# EasyEDA Pro project ESP32_Wroom.eprj, board PCB3
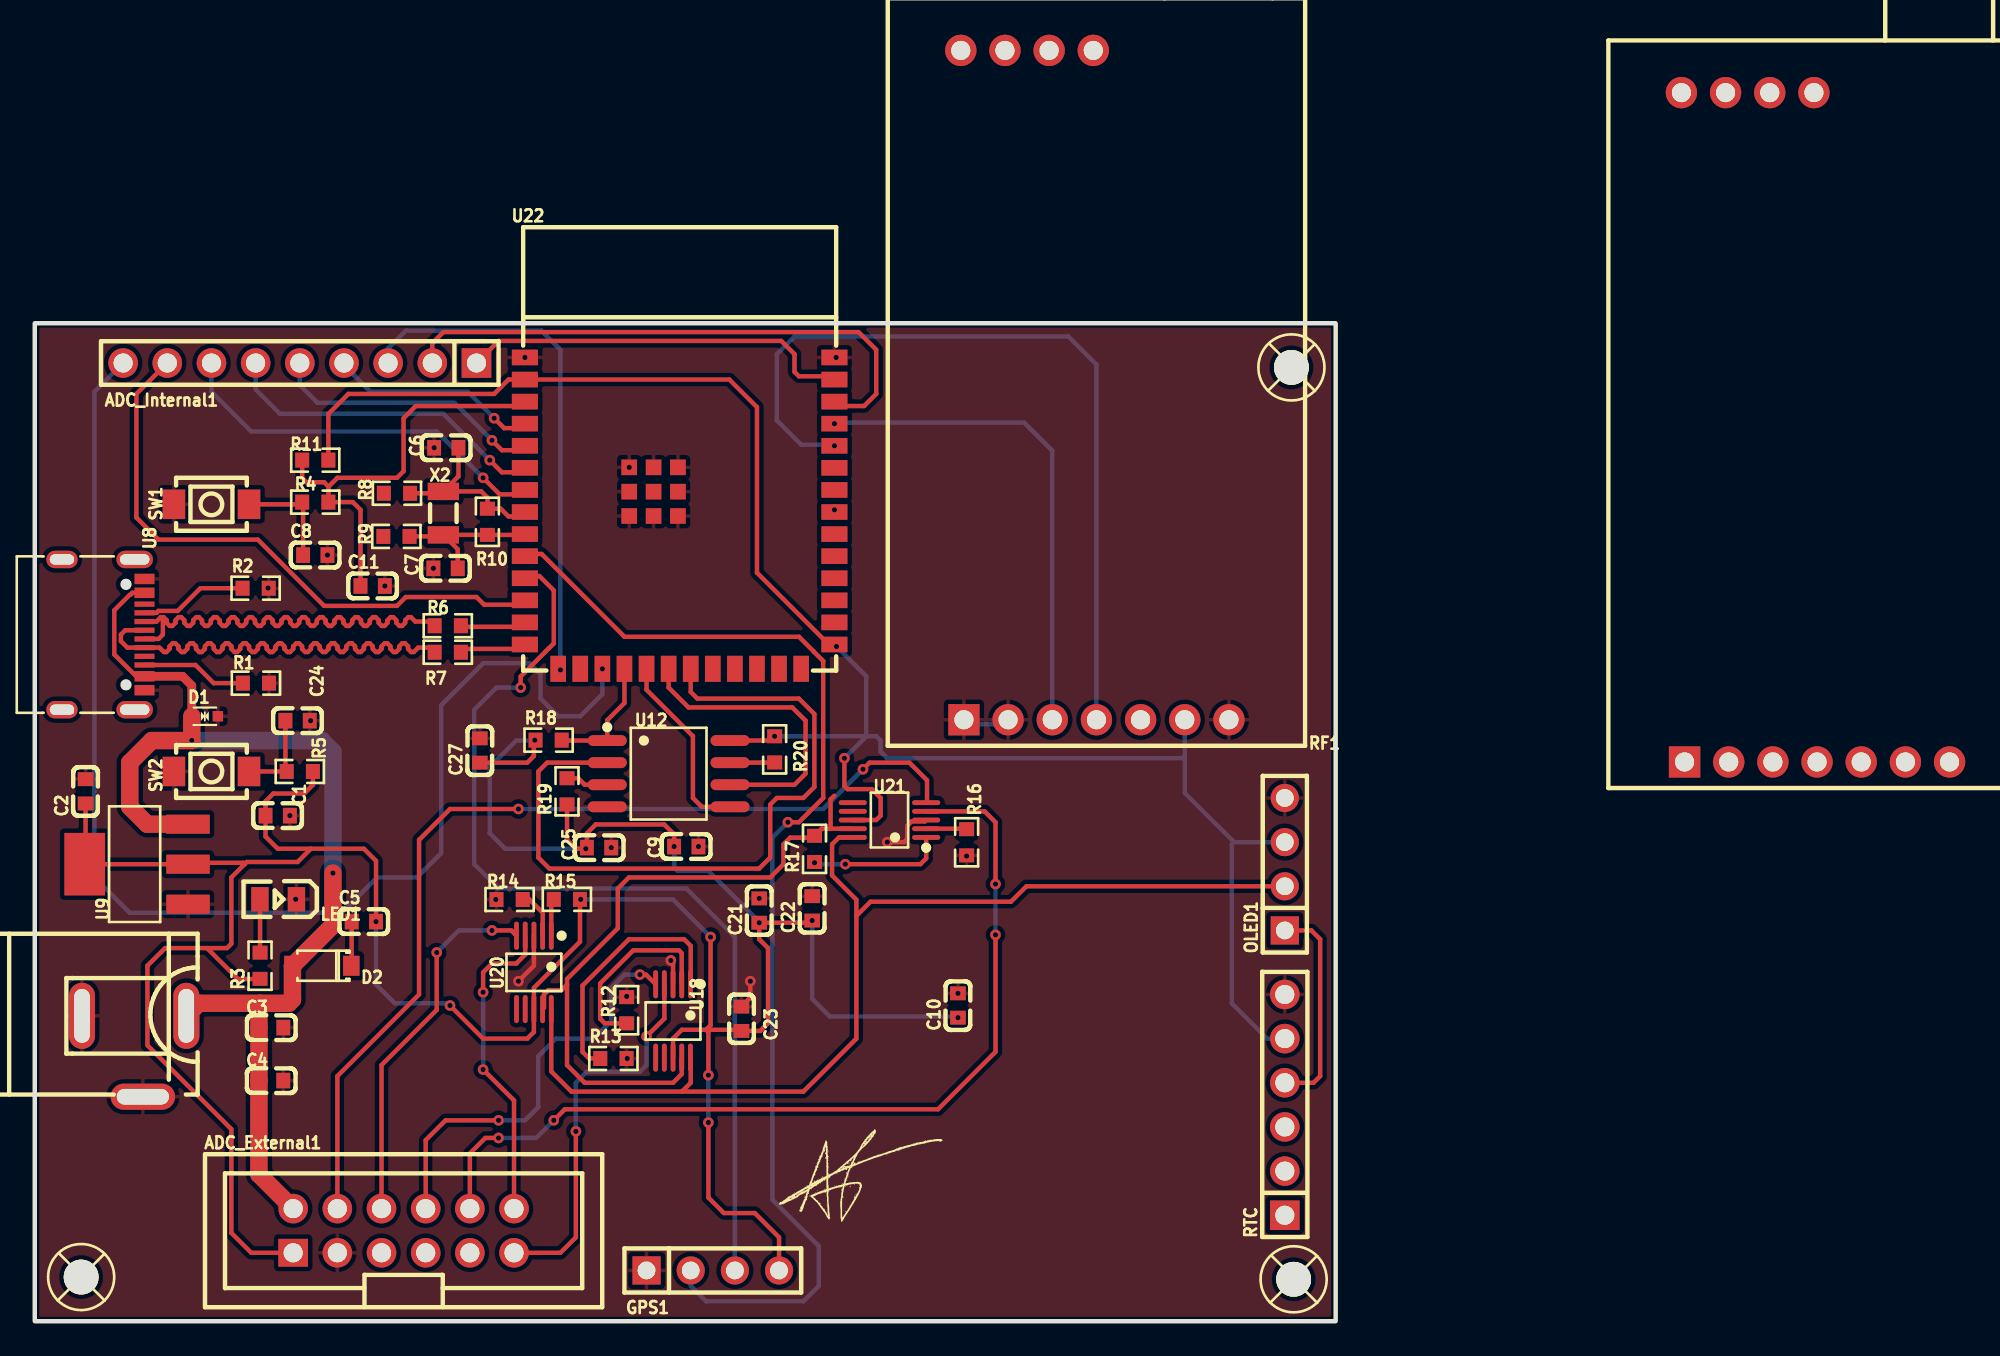
[diagram p5: board, top side]
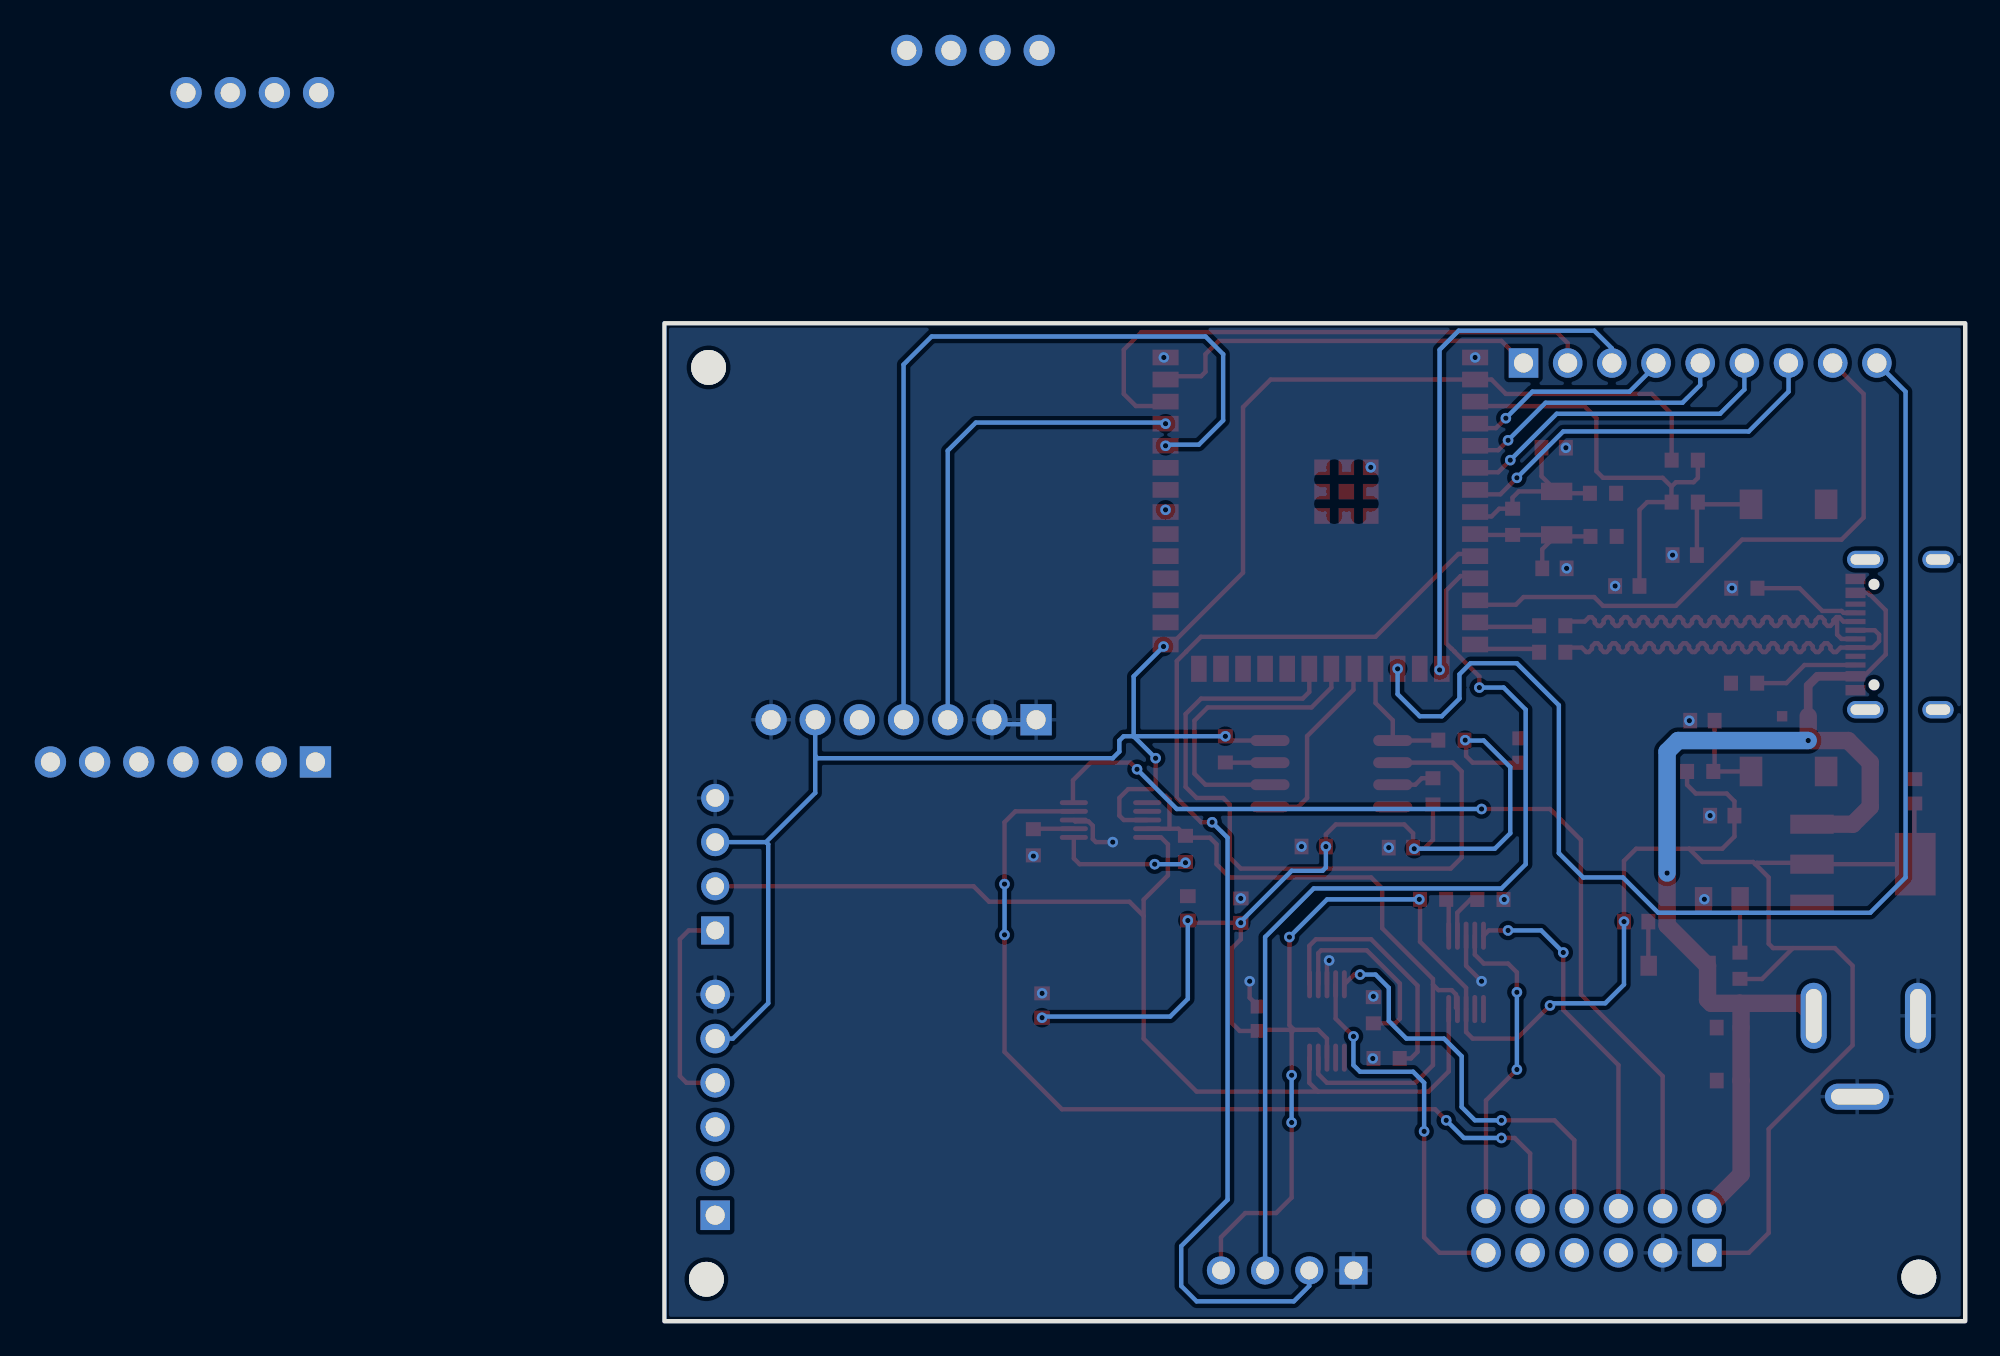
[diagram p6: board, bottom side, seen from below]

Outline 74.8 x 57.4 mm; copper layers: Top Layer, Bottom Layer. Coordinates in mm from the lower left corner of the outline.
Outline path: rectangle 0,57.4 74.8,0
Stack: Top Layer 0.035mm / Dielectric1 1.51mm FR4 er 4.5 / Bottom Layer 0.035mm

## Design rules (mm)
template: JLCPCB Capability(Two Layers Board)
spacing copperThickness1oz (default): track to track 0.102, other pairs 0.152 to 0.3
spacing copperThickness2oz: track to track 0.203, other pairs 0.152 to 0.3
track width copperThickness1oz (default): min 0.127, default 0.254, max 2.54
track width copperThickness2oz: min 0.203, default 0.254, max 2.54
differential pair differentialPair (default): width min 0.127, default 0.254, max 2.54; gap min 0.152, default 0.152
via viaSize (default): diameter min 0.5, default 0.61, max 10; hole min 0.3, default 0.305, max 6.3

## Placement (name value [footprint] x y rotation side)
ADC_External1  T821112A1R100CEU  [IDC-TH_12P-P2.54_BOOMELE-2X6P-2.54MM]  21.21 5.21 0 top
ADC_Internal1  PZ2.54-1*9  [HDR-TH_9P-P2.54-V-M]  15.24 55.12 180 top
C1  10uF  [C0603]  13.97 29.08 0 top
C2  100nF  [C0603]  2.92 30.48 90 top
C3  10uF  [C0603]  13.59 16.89 180 top
C4  100nF  [C0603]  13.59 13.84 180 top
C5  10uF  [C0603]  18.92 22.99 0 top
C6  12pF  [C0603]  23.66 50.24 0 top
C7  12pF  [C0603]  23.62 43.31 0 top
C8  100nF  [C0603]  16.13 44.07 0 top
C9  22uF  [C0603]  37.47 27.31 0 top
C10  100nF  [C0603]  53.09 18.16 90 top
C11  100nF  [C0603]  19.43 42.29 0 top
C21  1uF  [C0603]  41.66 23.62 90 top
C22  1uF  [C0603]  44.7 23.75 90 top
C23  1uF  [C0603]  40.64 17.4 90 top
C24  100nF  [C0603]  15.11 34.54 0 top
C25  100nF  [C0603]  32.45 27.24 180 top
C27  100nF  [C0603]  25.59 32.83 90 top
D1  LESD5D5.0CT1G  [SOD-523_L1.2-W0.8-LS1.6-BI]  9.78 34.8 0 top
D2  MBR0560  [SOD-123_L2.8-W1.8-LS3.7-RD]  16.51 20.45 180 top
GPS1  HX PH254-01-04-Z-L11.5 straight pin header  [HDR-TH_4P-HX-PH254-01-04-Z-L11.5]  38.99 2.92 0 top
LED1  KT-0805G  [LED0805-R-RD]  14 24.27 180 top
OLED1  HX PH254-01-04-Z-L11.5 straight pin header  [HDR-TH_4P-HX-PH254-01-04-Z-L11.5]  71.88 26.29 90 top
R1  5k  [R0603]  12.72 36.7 180 top
R2  5k  [R0603]  12.7 42.16 0 top
R3  330  [R0603]  12.95 20.45 90 top
R4  10K  [R0603]  16.13 47.12 180 top
R5  10K  [R0603]  15.24 31.62 0 top
R6  22  [R0603]  23.75 40.01 180 top
R7  22  [R0603]  23.75 38.48 180 top
R8  0  [R0603]  20.83 47.62 0 top
R9  0  [R0603]  20.8 45.14 0 top
R10  0  [R0603]  26.03 45.98 90 top
R11  0  [R0603]  16.13 49.53 0 top
R12  10K  [R0603]  34.04 17.89 90 top
R13  10K  [R0603]  33.27 15.11 0 top
R14  10K  [R0603]  27.31 24.26 180 top
R15  10K  [R0603]  30.6 24.27 0 top
R16  10K  [R0603]  53.59 27.55 270 top
R17  10K  [R0603]  44.84 27.17 90 top
R18  10K  [R0603]  29.55 33.42 0 top
R19  10K  [R0603]  30.61 30.48 90 top
R20  10K  [R0603]  42.54 32.89 90 top
RF1  E32-900T30D  [WIRELM-TH_E32-900T30D]  60.96 53.85 180 top
RF1#2  -  [WIRELM-TH_E32-900T30D]  102.4 51.42 180 top
RTC  HX PH254-01-06-Z-L11.5 through hole header  [HDR-TH_6P-P2.54-V-M]  71.88 12.45 90 top
SCREW1  -  [Screw-Hole-M2]  72.26 54.86 0 top
SCREW2  -  [Screw-Hole-M2]  72.39 2.41 0 top
SCREW2#2  -  [Screw-Hole-M2]  2.67 2.54 0 top
SW1  HX 3x4x2-2P-1.6N TACTILE SWITCH  [KEY-SMD_L4.0-W3.0-LS4.9-1]  10.16 46.99 0 top
SW2  HX 3x4x2-2P-1.6N TACTILE SWITCH  [KEY-SMD_L4.0-W3.0-LS4.9-1]  10.16 31.62 0 top
U8  TYPE C-ZL-104PWB  [TYPE-C-SMD_HDGC_TYPE-C-ZL-104PWB]  3.94 39.5 270 top
U9  AMS1117-3.3  [SOT-223-3_L6.5-W3.4-P2.30-LS7.0-BR]  5.84 26.29 0 top
U12  W25Q128JVSIQ  [SOIC-8_L5.3-W5.3-P1.27-LS8.0-BL]  36.45 31.5 270 top
U18  ADS1115IDGSR  [MSOP-10_L3.0-W3.0-P0.50-LS5.0-BL]  36.7 17.27 180 top
U19  POWER-JACK  [DC-IN-TH_POWER-JACK]  5.72 15.24 0 top
U20  ADS1115IDGSR  [MSOP-10_L3.0-W3.0-P0.50-LS5.0-BL]  28.7 20.07 180 top
U21  ADS1115IDGSR  [MSOP-10_L3.0-W3.0-P0.50-LS5.0-BL]  49.15 28.83 90 top
U22  2.4GHz  [WIFIM-SMD_ESP32-S3-WROOM-1-N8]  37.08 46.48 0 top
X2  32.768kHz  [FC-135R_L3.2-W1.5]  23.5 46.48 270 top

## Footprints (pads in the part's own frame, mm; a bottom-side part is the same pattern mirrored in y, then rotated)
C0603
  rect 0.8x0.9 smd: 1(-0.7,0) 2(0.7,0)
DC-IN-TH_POWER-JACK
  oval 1.5x3.8 hole 0.9x3.1: 1(2.999,2.325) 2(-2.999,2.325)
  oval 3.7x1.5 hole 3x0.9: 3(0.5,-2.325)
FC-135R_L3.2-W1.5
  rect 1x1.8 smd: 1(-1.25,0) 2(1.25,0)
HDR-TH_4P-HX-PH254-01-04-Z-L11.5
  rect 1.62x1.62 hole 1.02: 1(-3.81,0)
  round 1.62 hole 1.02: 2(-1.27,0) 3(1.27,0) 4(3.81,0)
HDR-TH_6P-P2.54-V-M
  rect 1.7x1.7 hole 1.1: 1(-6.35,0)
  round 1.7 hole 1.1: 2(-3.81,0) 3(-1.27,0) 4(1.27,0) 5(3.81,0) 6(6.35,0)
HDR-TH_9P-P2.54-V-M
  rect 1.7x1.7 hole 1.1: 1(-10.16,0)
  round 1.7 hole 1.1: 2(-7.62,0) 3(-5.08,0) 4(-2.54,0) 5(0,0) 6(2.54,0) 7(5.08,0) 8(7.62,0) 9(10.16,0)
IDC-TH_12P-P2.54_BOOMELE-2X6P-2.54MM
  rect 1.7x1.6 hole 1.1: 1(-6.35,-1.27)
  round 1.7 hole 1.1: 2(-6.35,1.27) 3(-3.81,-1.27) 4(-3.81,1.27) 5(-1.27,-1.27) 6(-1.27,1.27) 7(1.27,-1.27) 8(1.27,1.27) 9(3.81,-1.27) 10(3.81,1.27) 11(6.35,-1.27) 12(6.35,1.27)
KEY-SMD_L4.0-W3.0-LS4.9-1
  rect 1.3x1.7 smd: 1(-2.159,0) 2(2.159,0)
LED0805-R-RD
  rect 1x1.399 smd: 1(1.05,0) 2(-1.05,0)
MSOP-10_L3.0-W3.0-P0.50-LS5.0-BL
  oval 0.28x1.62 smd: 1(-1,-2.11) 2(-0.5,-2.11) 3(0,-2.11) 4(0.5,-2.11) 5(1,-2.11) 6(1,2.11) 7(0.5,2.11) 8(0,2.11) 9(-0.5,2.11) 10(-1,2.11)
R0603
  rect 0.806x0.864 smd: 1(-0.753,0) 2(0.753,0)
Screw-Hole-M2
  round 2 hole 2: 1(0,0)
SOD-123_L2.8-W1.8-LS3.7-RD
  rect 0.95x1.15 smd: 1(-1.692,0) 2(1.692,0)
SOD-523_L1.2-W0.8-LS1.6-BI
  rect 0.6x0.6 smd: 1(-0.75,0) 2(0.75,0)
SOIC-8_L5.3-W5.3-P1.27-LS8.0-BL
  oval 0.63x2.25 smd: 1(-1.905,-3.53) 2(-0.635,-3.53) 3(0.635,-3.53) 4(1.905,-3.53) 5(1.905,3.53) 6(0.635,3.53) 7(-0.635,3.53) 8(-1.905,3.53)
SOT-223-3_L6.5-W3.4-P2.30-LS7.0-BR
  rect 2.5x1.1 smd: 1(2.97,-2.3) 2(2.97,0) 3(2.97,2.3)
  rect 2.34x3.6 smd: 4(-2.97,0)
TYPE-C-SMD_HDGC_TYPE-C-ZL-104PWB
  oval 1x2.1 hole 0.6x1.7: 12(-4.32,1.808) 13(4.32,1.808)
  oval 1x1.8 hole 0.6x1.4: 14(-4.32,-2.373) 15(4.32,-2.373)
  rect 0.6x1.15 smd: A1B12(-3.2,2.373) A4B9(-2.4,2.373) A9B4(2.4,2.373) A12B1(3.2,2.373)
  rect 0.3x1.15 smd: A5(-1.25,2.373) A6(-0.25,2.373) A7(0.25,2.373) A8(1.25,2.373) B5(1.75,2.373) B6(0.75,2.373) B7(-0.75,2.373) B8(-1.75,2.373)
WIFIM-SMD_ESP32-S3-WROOM-1-N8
  rect 1.5x0.9 smd: 1(-8.9,8.954) 2(-8.9,7.684) 3(-8.9,6.415) 4(-8.9,5.144) 5(-8.9,3.874) 6(-8.9,2.604) 7(-8.9,1.335) 8(-8.9,0.065) 9(-8.9,-1.206) 10(-8.9,-2.475) 11(-8.9,-3.745) 12(-8.9,-5.016) 13(-8.9,-6.285) 14(-8.9,-7.556) 27(8.9,-7.556) 28(8.9,-6.285) 29(8.9,-5.016) 30(8.9,-3.745) 31(8.9,-2.475) 32(8.9,-1.206) 33(8.9,0.065) 34(8.9,1.335) 35(8.9,2.604) 36(8.9,3.874) 37(8.9,5.144) 38(8.9,6.415) 39(8.9,7.684) 40(8.9,8.954)
  rect 0.9x1.5 smd: 15(-6.985,-8.954) 16(-5.715,-8.954) 17(-4.445,-8.954) 18(-3.175,-8.954) 19(-1.905,-8.954) 20(-0.635,-8.954) 21(0.635,-8.954) 22(1.905,-8.954) 23(3.175,-8.954) 24(4.445,-8.954) 25(5.715,-8.954) 26(6.985,-8.954)
  rect 0.9x0.9 smd: 41(-2.9,2.635) 41(-2.9,1.235) 41(-2.9,-0.165) 41(-1.5,2.635) 41(-1.5,1.235) 41(-1.5,-0.165) 41(-0.1,2.635) 41(-0.1,1.235) 41(-0.1,-0.165)
WIRELM-TH_E32-900T30D
  rect 1.8x1.8 hole 1.1: 1(7.53,19.25)
  round 1.8 hole 1.1: 2(4.99,19.25) 3(2.45,19.25) 4(-0.09,19.25) 5(-2.63,19.25) 6(-5.17,19.25) 7(-7.71,19.25) 8(0.09,-19.25) 9(2.63,-19.25) 10(5.17,-19.25) 11(7.71,-19.25)

## Nets
As in the schematic, except:
3.3V: ADC_External1.1 C1.1 C2.1 C5.2 C9.1 C10.1 C21.1 C22.1 C23.1 C25.2 C27.1 GPS1.4 OLED1.3 R3.1 R5.2 R11.2 R15.2 R18.1 R19.1 R20.2 RF1.6 RF1#2.6 RTC.5 U9.2 U9.4 U12.8 U18.8 U20.8 U21.8 U22.2 U22.27
GND: ADC_External1.3 C1.2 C2.2 C3.1 C4.1 C6.1 C7.1 C8.2 C9.2 C10.2 C11.2 C21.2 C22.2 C23.2 C24.2 C25.1 C27.2 D1.2 GPS1.1 LED1.2 OLED1.4 R1.1 R2.2 R12.2 R13.2 R14.2 R16.2 RF1.1 RF1.2 RF1.7 RF1#2.1 RF1#2.2 RF1#2.7 RTC.6 SW1.1 SW2.1 U8.A1B12 U8.A12B1 U9.1 U12.4 U18.3 U19.2 U19.3 U20.3 U21.3 U22.1 U22.40 U22.41
GP40: RF1.5 RF1#2.5 U22.33
RX: RF1.4 RF1#2.4 U22.36
TX: RF1.3 RF1#2.3 U22.37

Pads without a net: ADC_External1 5 7 9; RF1 8 9 10 11; RF1#2 8 9 10 11; SCREW1 1; SCREW2 1; SCREW2#2 1; U8 12 13 14 15 A8 B8; U18 6 7; U20 6 7; U21 6 7; U22 16 22 23 24 25 26 28 29 30 31 32

## Via types
v1: diameter 0.61, hole 0.305, Top Layer to Bottom Layer, 67 vias

## Routing (per net, layer and track width the routed paths; a pad name or vN(x,y) marks a point on that pad's centre or on a via; arc(x,y) is an arc through that point)
3.3V: length 297.5
  Top Layer w0.254: 12.06,26.29 11.3,25.53 11.3,21.72 11.05,21.46 9.91,21.46 ; 12.06,26.29 12.19,26.42 15.11,26.42 15.88,27.18 ; 12.06,26.29 11.99,26.37 8.89,26.37 U9.2 U9.4 2.92,26.34 C2.1 ; v1(42.54,33.65) 42.3,33.4 U12.8 ; 9.91,21.46 7.49,21.46 6.48,20.45 6.48,15.88 11.3,11.05 11.3,5.08 12.45,3.94 ADC_External1.1 ; 9.91,21.46 11.68,19.69 12.95,19.69 R3.1 ; R5.2 15.99,30.85 15.49,30.35 13.72,30.35 13.27,29.91 C1.1 13.27,27.88 13.97,27.18 15.88,27.18 ; 38.6,16.76 38.86,17.03 v1(38.86,22.1) ; 38.6,16.76 38.74,16.63 v1(38.74,14.15) ; 38.6,16.76 40.57,16.76 C23.1 41.72,16.7 42.16,17.15 42.16,21.46 41.66,21.97 41.66,22.92 v1(41.66,22.92) 44.58,22.92 v1(44.7,23.05) ; 38.6,16.76 37.21,16.76 36.7,16.26 U18.8 ; v1(38.74,11.43) 38.74,7.11 39.62,6.22 41.4,6.22 42.8,4.83 GPS1.4 ; R18.1 28.7,33.33 28.7,32.51 28.32,32.13 C27.1 ; R19.1 30.61,27.69 31.12,27.18 v1(31.69,27.18) C25.2 31.75,28.07 32.26,28.58 36.19,28.58 36.77,28.01 v1(36.77,27.31) ; v1(46.1,38.81) 45.78,38.81 41.53,43.06 41.53,52.58 39.94,54.17 U22.2 27.24,54.17 26.42,53.34 18.03,53.34 16.88,52.19 R11.2 ; 15.88,27.18 18.92,27.18 19.62,26.48 v1(19.62,22.99) ; v1(23.88,18.16) 25.78,16.26 28.32,16.26 28.7,16.64 U20.8 28.7,19.18 31.35,21.83 R15.2 ; U21.8 48.39,28.83 48.64,29.08 48.64,30.1 48.13,30.61 46.74,30.61 46.56,30.79 v1(46.56,32.39)
  Bottom Layer w0.254: 68.96,27.56 68.83,27.43 68.83,18.29 70.87,16.26 RTC.5 ; 68.96,27.56 66.13,30.39 66.13,32.52 ; 68.96,27.56 72.52,27.56 ; v1(53.09,17.46) 53.02,17.53 45.72,17.53 44.7,18.54 v1(44.7,23.05) ; v1(36.77,27.31) 36.77,26.1 36.96,25.91 38.74,25.91 41.66,22.99 ; v1(31.69,27.18) 27.05,27.18 26.16,28.07 26.16,31.88 27.69,33.4 28.7,33.4 ; v1(31.39,24.27) 36.69,24.27 v1(38.86,22.1) ; v1(38.74,14.15) v1(38.74,11.43) ; 47.82,33.65 47.82,37.09 v1(46.1,38.81) ; 47.82,33.65 v1(46.56,32.39) ; 47.82,33.65 48.4,33.65 48.64,33.4 48.64,32.77 49.02,32.39 66,32.39 66.13,32.52 ; 47.82,33.65 v1(42.54,33.65) ; v1(23.88,18.16) 23.75,18.29 20.7,18.29 19.62,19.37 v1(19.62,22.99) ; 66.13,32.52 RF1.6
  vias: v1(28.75,33.42)
GND: length 12.1
  Top Layer w0.254: U21.3 51.18,28.75 50.42,28.75 50.17,28.5 50.17,27.74 49.99,27.56 v1(49.02,27.56) ; v1(27.81,19.56) 28.7,20.45 U20.3 ; v1(41.15,19.56) 41.15,18.61 C23.2 ; U18.3 36.7,20.62 v1(36.58,20.75)
  Bottom Layer w0.254: 56.05,34.52 55.87,34.34 53.69,34.34 RF1.1
  vias: v1(13.42,42.17) v1(14.67,29.08) v1(15,24.27) v1(15.86,34.54) v1(16.83,44.07) v1(20.13,42.29) v1(22.96,50.24) v1(22.92,43.31) v1(26.51,24.26) v1(28.18,55.44) v1(33.15,27.24) v1(34.04,18.68) v1(34.07,15.11) v1(34.18,49.12) v1(38.16,27.31) v1(41.66,24.32) v1(46.08,55.44) v1(53.09,18.86) v1(53.59,26.76)
VBUS: length 66.2
  Top Layer w0.254: U8.A4B9 5.61,41.9 5.5,41.78 5.46,41.78 4.57,40.89 4.57,38.35 5.83,37.1 U8.A9B4
  Top Layer w0.5: D1.1 9.03,36.56 8.5,37.1 U8.A9B4
  Top Layer w1: 12.96,18.29 14.61,18.29 14.82,18.5 D2.2 17.15,22.77 v1(17.15,25.78) ; 12.96,18.29 9.44,18.29 U19.1 ; 12.96,18.29 12.89,18.22 C3.2 12.89,13.85 C4.2 12.89,8.45 ADC_External1.2 ; D1.1 v1(9.03,33.4) 6.73,33.4 5.46,32.13 5.46,29.59 6.46,28.59 U9.3
  Bottom Layer w1: v1(9.03,33.4) 16.51,33.4 17.15,32.77 v1(17.15,25.78)
A1: length 22.4
  Top Layer w0.254: v1(31.12,10.92) 31.12,4.83 30.23,3.94 ADC_External1.11 ; U18.4 36.2,17.41 v1(35.18,16.38)
  Bottom Layer w0.254: v1(31.12,10.92) 31.12,13.72 31.75,14.35 34.8,14.35 35.18,14.73 v1(35.18,16.38)
A2: length 24.2
  Top Layer w0.254: ADC_External1.8 22.48,10.41 23.62,11.56 v1(26.67,11.56) ; v1(34.8,19.94) 35.15,19.94 U18.5
  Bottom Layer w0.254: v1(26.67,11.56) 28.19,11.56 28.96,12.32 28.96,15.24 29.97,16.26 32.13,16.26 33.15,17.27 33.15,19.18 33.91,19.94 v1(34.8,19.94)
A3: length 18.3
  Top Layer w0.254: v1(25.78,14.48) 27.56,12.7 ADC_External1.12 ; v1(25.78,18.92) 25.78,20.07 26.29,20.57 27.69,20.57 28.2,21.09 U20.4
  Bottom Layer w0.254: v1(25.78,14.48) v1(25.78,18.92)
A4: length 21.3
  Top Layer w0.254: v1(26.29,22.48) 27.4,22.48 U20.5 ; ADC_External1.6 19.94,14.73 23.11,17.91 v1(23.11,21.21)
  Bottom Layer w0.254: v1(23.11,21.21) 24.38,22.48 v1(26.29,22.48)
A5: length 53.3
  Top Layer w0.254: v1(55.25,25.15) 55.25,28.7 54.62,29.33 U21.4 ; ADC_External1.10 25.02,9.65 25.91,10.54 v1(26.67,10.54) ; v1(29.84,11.56) 30.48,12.19 51.94,12.19 55.25,15.49 v1(55.25,22.23)
  Bottom Layer w0.254: v1(29.84,11.56) 28.83,10.54 v1(26.67,10.54) ; v1(55.25,25.15) v1(55.25,22.23)
A6: length 55.9
  Top Layer w0.254: ADC_External1.4 17.4,14.1 22.1,18.8 22.1,27.69 23.88,29.46 v1(27.81,29.46) ; v1(47.62,31.75) 48.01,32.13 50.29,32.13 51.31,31.12 51.31,29.88 U21.5
  Bottom Layer w0.254: v1(47.62,31.75) 45.34,29.46 v1(27.81,29.46)
ADC1_0: length 22.7
  Top Layer w0.254: 45.98,53.91 45.54,54.36 43.94,54.36 43.69,54.61 43.69,55.63 42.93,56.39 26.67,56.39 ADC_Internal1.1
ADC1_1: length 32.6
  Top Layer w0.254: 45.98,52.64 47.69,52.64 48.39,53.34 48.39,55.88 47.37,56.9 23.5,56.9 22.86,56.26 ADC_Internal1.2
ADC1_2: length 30
  Bottom Layer w0.254: v1(30.23,37.47) 30.23,55.88 29.13,56.98 21.34,56.98 20.32,55.96 ADC_Internal1.3
ADC1_3: length 12
  Top Layer w0.254: v1(26.42,51.94) 26.99,51.37 28.18,51.37
  Bottom Layer w0.254: ADC_Internal1.4 17.78,54.99 19.3,53.47 24.89,53.47 v1(26.42,51.94)
ADC1_4: length 15.8
  Top Layer w0.254: v1(26.29,50.67) 26.86,50.1 28.18,50.1
  Bottom Layer w0.254: v1(26.29,50.67) 24.13,52.83 16.26,52.83 15.24,53.85 ADC_Internal1.5
ADC1_5: length 19
  Top Layer w0.254: v1(26.16,49.53) 26.86,48.83 28.18,48.83
  Bottom Layer w0.254: ADC_Internal1.6 12.7,53.59 14.1,52.2 23.5,52.2 v1(26.16,49.53)
ADC1_6: length 22.1
  Top Layer w0.254: 28.18,47.56 26.73,47.56 v1(25.78,48.51)
  Bottom Layer w0.254: v1(25.78,48.51) 23.11,51.18 12.45,51.18 10.16,53.47 ADC_Internal1.7
ADC1_7: length 34.5
  Top Layer w0.254: ADC_Internal1.8 5.84,53.34 5.84,46.23 7.11,44.96 12.83,44.96 16.64,41.15 20.83,41.15 21.34,41.66 25.4,41.66 25.84,41.21 28.18,41.21
ADC1_8: length 75.3
  Bottom Layer w0.254: ADC_Internal1.9 3.43,53.47 3.43,25.53 5.46,23.5 17.65,23.5 19.69,25.53 21.97,25.53 23.37,26.92 23.37,35.43 25.78,37.85 28.45,37.85 29.08,37.21 29.08,35.81 30.1,34.8 31.37,34.8 32.64,36.07 v1(32.64,37.53)
D+: length 3.8
  Top Layer w0.254: 28.18,38.67 24.69,38.67 R7.1
D-: length 3.7
  Top Layer w0.254: 28.18,39.94 24.56,39.94 R6.1
EN: length 25.1
  Top Layer w0.254: 16.89,48.01 16.89,47.13 R4.1 18.29,47.12 18.73,46.67 C11.1 ; 16.89,48.01 17.4,48.51 20.83,48.51 21.21,48.9 21.21,51.94 21.91,52.64 28.18,52.64 ; 16.89,48.01 16.64,48.26 15.62,48.26 15.38,48.51 R11.1
GP10: length 6.9
  Top Layer w0.254: 33.91,37.27 33.91,35.56 32.92,34.57 U12.1 30.32,33.4 R18.2
GP11: length 10.6
  Top Layer w0.254: U12.5 38.35,29.59 37.85,30.1 37.85,33.66 35.18,36.32 35.18,37.27
GP12: length 17.1
  Top Layer w0.254: U12.6 43.69,30.86 44.32,31.5 44.32,34.54 43.56,35.31 37.59,35.31 36.45,36.45 36.45,37.27
GP13: length 41.9
  Top Layer w0.254: 37.72,37.27 37.72,36.2 38.1,35.81 43.94,35.81 44.83,34.93 44.83,30.73 44.2,30.1 42.67,30.1 42.29,29.72 42.29,26.67 41.66,26.04 29.59,26.04 28.96,26.67 28.96,31.62 29.46,32.13 U12.2
GP17: length 67.3
  Top Layer w0.254: 28.18,44.13 29.15,44.13 33.91,39.37 43.95,39.37 44.8,38.52 44.8,38.51 45.34,37.97 45.34,30.1 43.94,28.7 v1(43.31,28.7)
  Bottom Layer w0.254: GPS1.2 37.72,2.03 38.61,1.14 44.2,1.14 45.09,2.03 45.09,4.32 42.42,6.98 42.42,27.81 v1(43.31,28.7)
GP18: length 56.4
  Top Layer w0.254: v1(27.94,36.45) 27.94,37.08 29.37,38.51 29.37,38.52 29.53,38.68 29.54,38.68 29.84,38.99 29.84,42.04 29.02,42.86 28.18,42.86
  Bottom Layer w0.254: v1(27.94,36.45) 26.54,36.45 25.27,35.18 25.27,26.29 26.67,24.89 37.47,24.89 40.26,22.1 GPS1.3
GP40:
  vias: v1(45.98,46.67)
RX: length 47.6
  Bottom Layer w0.254: v1(45.98,50.36) 45.92,50.42 44.07,50.42 42.67,51.82 42.67,55.63 43.69,56.64 59.44,56.64 61.05,55.03 RF1.4
SCL: length 63.5
  Top Layer w0.254: 47.24,23.32 47.24,16.26 44.2,13.21 37.21,13.21 ; 47.24,23.32 47.24,24.25 45.85,25.64 45.85,27.43 46.24,27.83 U21.10 ; 47.24,23.32 48.06,24.13 56.13,24.13 57.02,25.02 OLED1.2 ; 37.21,13.21 30.86,13.21 29.7,14.37 U20.10 ; 37.21,13.21 37.72,13.72 37.72,15.15 U18.10
SDA: length 51.9
  Top Layer w0.254: 30.61,19.36 30.61,19.69 33.53,22.61 33.53,24.89 34.16,25.53 42.29,25.53 43.05,26.29 43.05,27.43 43.43,27.81 44.73,27.81 R17.2 45.25,28.33 45.76,28.33 ; 30.61,19.36 30.61,14.73 31.62,13.72 36.7,13.72 37.2,14.22 U18.9 ; 30.61,19.36 30.29,19.05 29.53,19.05 29.28,18.8 29.28,18.04 U20.9 ; 45.76,28.33 45.76,30.01 45.97,30.23 ; 45.76,28.33 U21.9 ; OLED1.1 73.41,22.48 73.91,21.97 73.91,14.1 73.53,13.72 71.88,13.72
TX: length 28.7
  Bottom Layer w0.254: v1(45.98,51.63) 46.05,51.69 56.9,51.69 58.51,50.08 RF1.3
XTALN: length 9
  Top Layer w0.254: X2.2 24.32,44.41 C7.2 ; X2.2 26.02,45.23 R10.1 27.98,45.23 28.18,45.02 ; X2.2 23.41,45.14 21.55,45.14
XTALP: length 10.5
  Top Layer w0.254: X2.1 23.39,47.62 R8.2 ; X2.1 25.67,47.73 26.03,47.37 26.03,46.74 R10.2 26.8,46.74 27.24,46.29 28.18,46.29 ; X2.1 24.36,48.6 C6.2
$1N2640: length 28.7
  Top Layer w0.254: U8.A6 5.2,39.75 4.95,39.5 4.95,39.12 5.32,38.75 U8.B6 7.17,38.75 7.42,38.49 7.57,38.49 7.75,38.67 7.75,38.82 7.93,39 8.08,39 8.26,38.82 8.26,38.67 8.44,38.49 8.59,38.49 8.77,38.67 8.77,38.82 8.95,39 9.09,39 9.27,38.82 9.27,38.67 9.45,38.49 9.6,38.49 9.78,38.67 9.78,38.82 9.96,39 10.11,39 10.29,38.82 10.29,38.67 10.47,38.49 10.62,38.49 10.8,38.67 10.8,38.82 10.98,39 11.13,39 11.31,38.82 11.31,38.67 11.49,38.49 11.64,38.49 11.81,38.67 11.81,38.82 11.99,39 12.14,39 12.32,38.82 12.32,38.67 12.5,38.49 12.65,38.49 12.83,38.67 12.83,38.82 13.01,39 13.16,39 13.34,38.82 13.34,38.67 13.52,38.49 13.67,38.49 13.85,38.67 13.85,38.82 14.03,39 14.17,39 14.35,38.82 14.35,38.67 14.53,38.49 14.68,38.49 14.86,38.67 14.86,38.82 15.04,39 15.19,39 15.37,38.82 15.37,38.67 15.55,38.49 15.7,38.49 15.88,38.67 15.88,38.82 16.06,39 16.21,39 16.39,38.82 16.39,38.67 16.57,38.49 16.72,38.49 16.89,38.67 16.89,38.82 17.07,39 17.22,39 17.4,38.82 17.4,38.67 17.58,38.49 17.73,38.49 17.91,38.67 17.91,38.82 18.09,39 18.24,39 18.42,38.82 18.42,38.67 18.6,38.49 18.75,38.49 18.93,38.67 18.93,38.82 19.11,39 19.25,39 19.43,38.82 19.43,38.67 19.61,38.49 19.76,38.49 19.94,38.67 19.94,38.82 20.12,39 20.27,39 20.45,38.82 20.45,38.67 20.63,38.49 20.78,38.49 20.96,38.67 20.96,38.82 21.14,39 21.29,39 21.47,38.82 21.47,38.67 21.65,38.49 21.79,38.49 22.05,38.75 22.73,38.75 R7.2
$1N2644: length 6.1
  Top Layer w0.254: U8.B5 9.24,37.75 10.29,36.7 R1.2
$1N2650: length 27.5
  Top Layer w0.254: 7.26,40.5 7.37,40.39 7.37,39.5 7.12,39.25 U8.A7 ; 7.26,40.5 7,40.25 U8.B7 ; 7.26,40.5 7.4,40.5 7.58,40.32 7.58,40.17 7.76,39.99 7.91,39.99 8.09,40.17 8.09,40.32 8.27,40.5 8.42,40.5 8.6,40.32 8.6,40.17 8.78,39.99 8.93,39.99 9.11,40.17 9.11,40.32 9.29,40.5 9.44,40.5 9.62,40.32 9.62,40.17 9.8,39.99 9.94,39.99 10.12,40.17 10.12,40.32 10.3,40.5 10.45,40.5 10.63,40.32 10.63,40.17 10.81,39.99 10.96,39.99 11.14,40.17 11.14,40.32 11.32,40.5 11.47,40.5 11.65,40.32 11.65,40.17 11.83,39.99 11.98,39.99 12.16,40.17 12.16,40.32 12.34,40.5 12.48,40.5 12.66,40.32 12.66,40.17 12.84,39.99 12.99,39.99 13.17,40.17 13.17,40.32 13.35,40.5 13.5,40.5 13.68,40.32 13.68,40.17 13.86,39.99 14.01,39.99 14.19,40.17 14.19,40.32 14.37,40.5 14.52,40.5 14.7,40.32 14.7,40.17 14.88,39.99 15.02,39.99 15.2,40.17 15.2,40.32 15.38,40.5 15.53,40.5 15.71,40.32 15.71,40.17 15.89,39.99 16.04,39.99 16.22,40.17 16.22,40.32 16.4,40.5 16.55,40.5 16.73,40.32 16.73,40.17 16.91,39.99 17.06,39.99 17.24,40.17 17.24,40.32 17.42,40.5 17.56,40.5 17.74,40.32 17.74,40.17 17.92,39.99 18.07,39.99 18.25,40.17 18.25,40.32 18.43,40.5 18.58,40.5 18.76,40.32 18.76,40.17 18.94,39.99 19.09,39.99 19.27,40.17 19.27,40.32 19.45,40.5 19.6,40.5 19.78,40.32 19.78,40.17 19.96,39.99 20.1,39.99 20.28,40.17 20.28,40.32 20.46,40.5 20.61,40.5 20.79,40.32 20.79,40.17 20.97,39.99 21.12,39.99 21.3,40.17 21.3,40.32 21.48,40.5 21.63,40.5 21.88,40.25 22.75,40.25 R6.2
$1N2651: length 6.2
  Top Layer w0.254: U8.A5 7,40.75 7.11,40.86 8.22,40.86 9.53,42.16 R2.1
$1N2657: length 2.5
  Top Layer w0.254: C5.1 18.22,20.47 D2.1
$1N2661: length 3.1
  Top Layer w0.254: R3.2 12.95,24.26 LED1.1
$1N2669: length 6.2
  Top Layer w0.254: C8.1 15.43,47.06 R4.2 15.25,46.99 SW1.2
$1N2671: length 5.1
  Top Layer w0.254: C24.1 14.41,31.7 R5.1 SW2.2
$1N2698: length 14.7
  Top Layer w0.254: U18.1 37.72,19.4 37.72,21.59 37.34,21.97 34.16,21.97 31.5,19.3 31.5,15.49 31.88,15.11 R13.1
$1N2699: length 11
  Top Layer w0.254: U18.2 37.2,21.17 37.04,21.34 34.42,21.34 32.51,19.43 32.51,17.4 32.77,17.14 34.04,17.14
$1N2730: length 2.1
  Top Layer w0.254: U20.1 29.7,24.12 R15.1
$1N2731: length 2.8
  Top Layer w0.254: R14.1 28.45,24.26 29.21,23.5 29.21,22.18 U20.2
$1N2744: length 7.8
  Top Layer w0.254: v1(46.61,26.29) 50.93,26.29 51.26,26.62 U21.1
  Bottom Layer w0.254: v1(44.84,26.37) 44.93,26.29 v1(46.61,26.29)
$1N2745: length 2.3
  Top Layer w0.254: 53.6,28.32 53.59,28.33 U21.2
$1N2809: length 2.5
  Top Layer w0.254: R19.2 31.25,31.23 31.62,30.86 U12.3
$1N2816: length 2.6
  Top Layer w0.254: R20.1 42.54,32.13 U12.7

## Copper pours and planes (outline as drawn; the poured copper is in the pictures)
GND on Top Layer: -2.67,60.45 77.34,60.45 77.34,-2.16 -2.67,-2.16
GND on Bottom Layer: -1.52,60.58 80.52,60.58 80.52,-5.97 -1.52,-5.97
